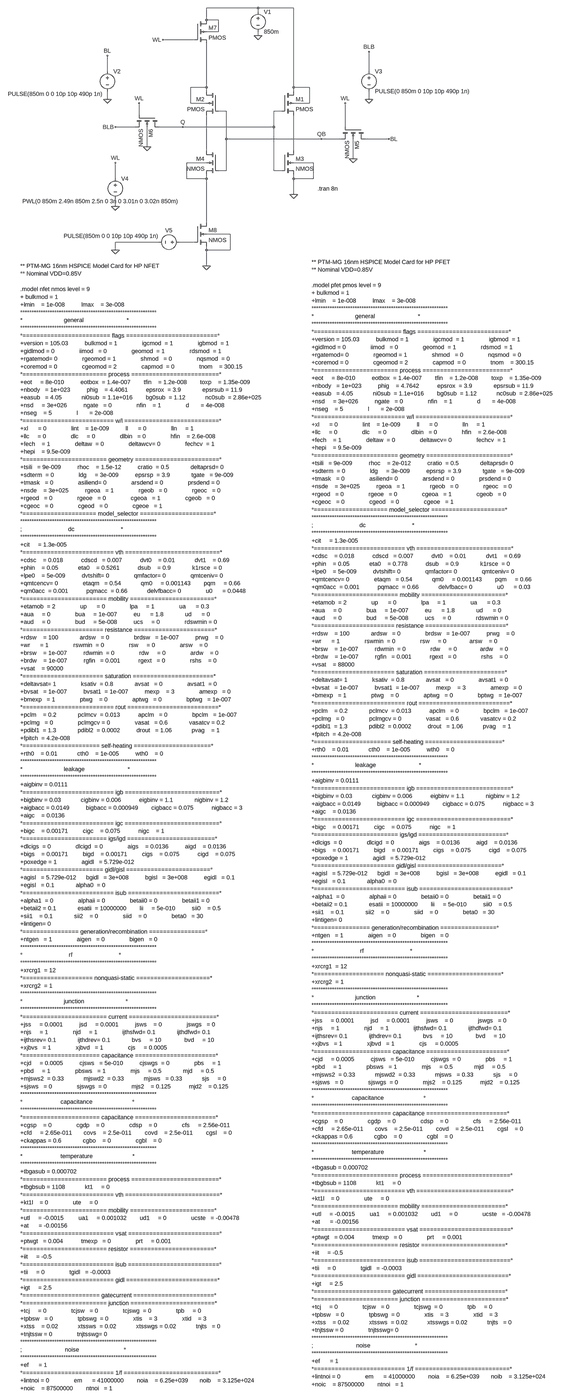
[diagram p0: schematic sram8t.asc, whole sheet]
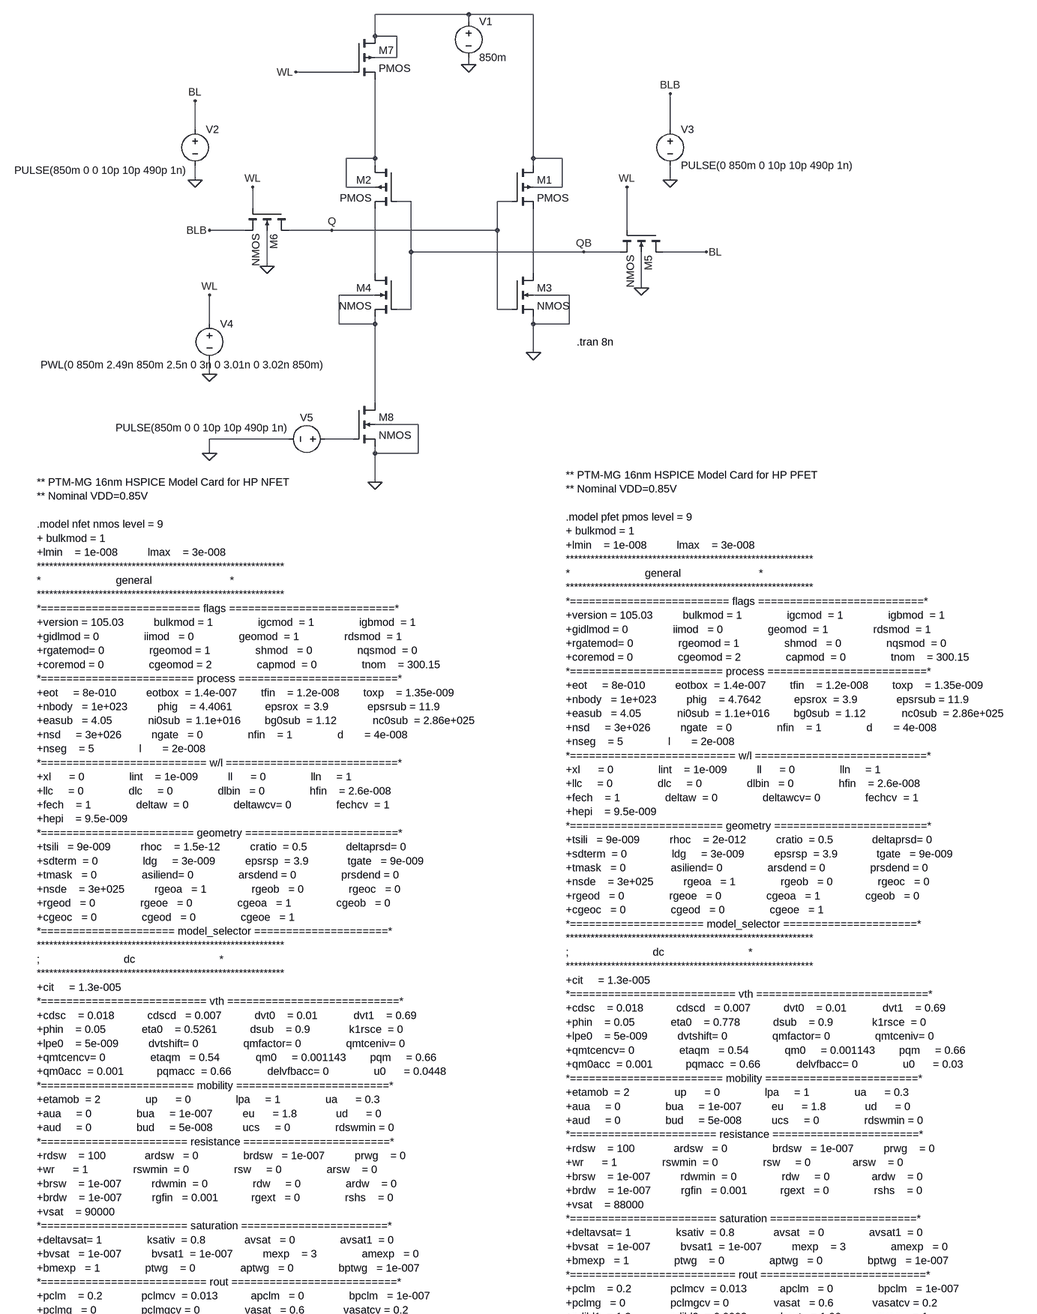
[diagram p1: schematic sram8t.asc, part, row 1 of 2, column 1 of 1]
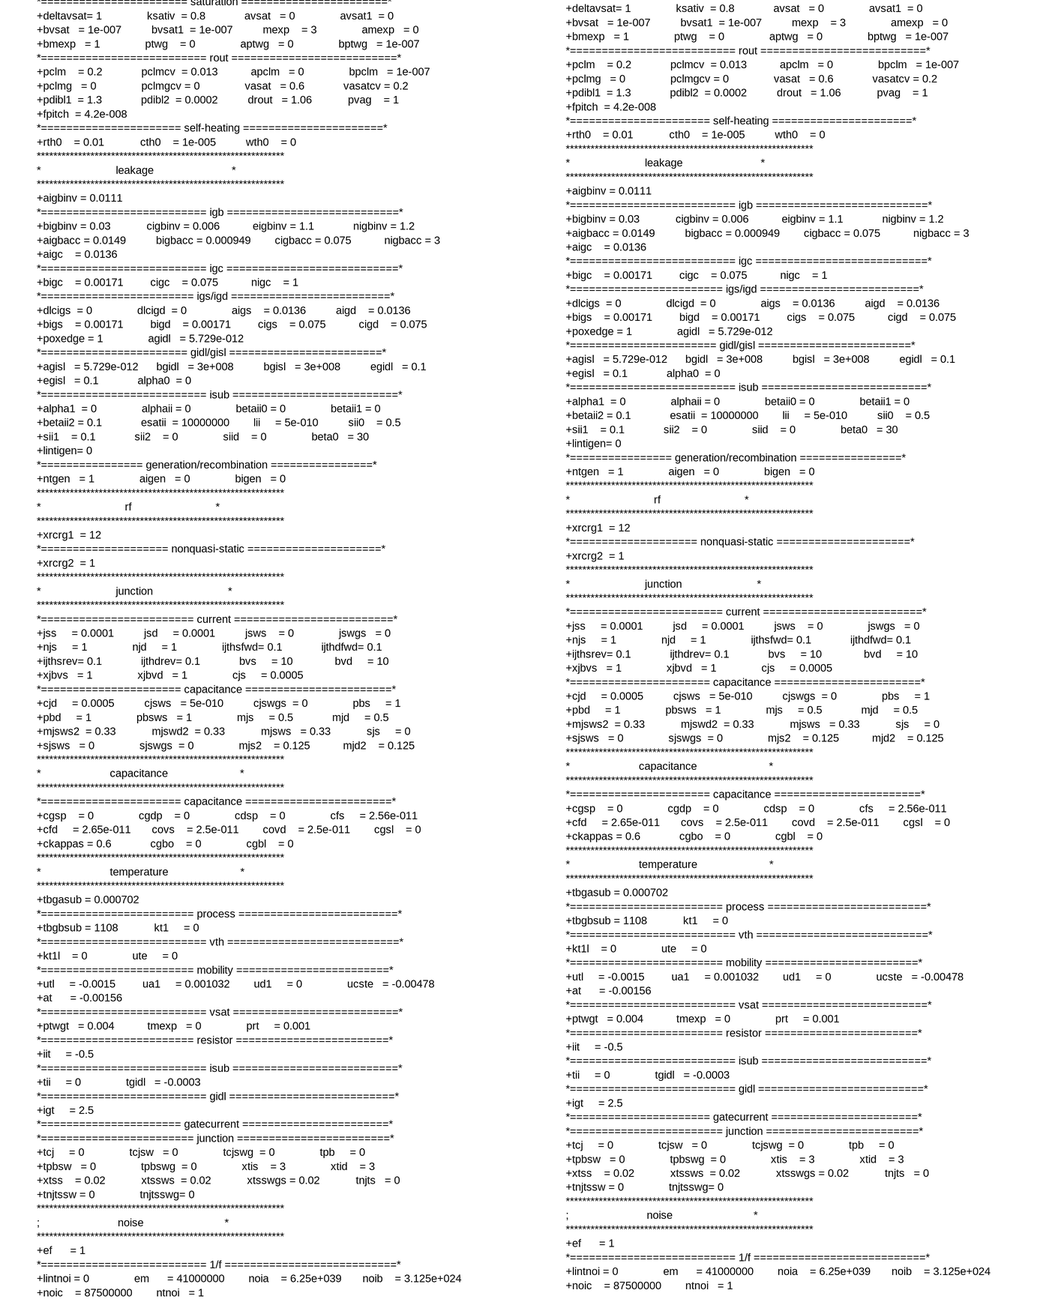
[diagram p2: schematic sram8t.asc, part, row 2 of 2, column 1 of 1]
sram8t.asc, the LTspice schematic file:
Version 4
SHEET 1 1636 4844
WIRE 224 -272 16 -272
WIRE 368 -272 224 -272
WIRE 224 -256 224 -272
WIRE 16 -224 16 -272
WIRE 64 -224 16 -224
WIRE 64 -176 64 -224
WIRE 64 -176 16 -176
WIRE 224 -160 224 -176
WIRE -32 -144 -160 -144
WIRE -384 -16 -384 -80
WIRE 672 -16 672 -96
WIRE 16 48 16 -128
WIRE 16 48 -48 48
WIRE 368 48 368 -272
WIRE 432 48 368 48
WIRE 16 64 16 48
WIRE 368 64 368 48
WIRE -384 96 -384 64
WIRE 672 96 672 64
WIRE -48 112 -48 48
WIRE 16 112 -48 112
WIRE 432 112 432 48
WIRE 432 112 368 112
WIRE 96 144 64 144
WIRE 320 144 288 144
WIRE -256 160 -256 112
WIRE -272 208 -352 208
WIRE -80 208 -176 208
WIRE 288 208 288 144
WIRE 288 208 -80 208
WIRE 576 208 576 112
WIRE 96 256 96 144
WIRE 480 256 96 256
WIRE 560 256 480 256
WIRE 752 256 656 256
WIRE -224 288 -224 208
WIRE 16 304 16 160
WIRE 368 304 368 160
WIRE 608 336 608 256
WIRE 16 352 -64 352
WIRE 448 352 368 352
WIRE 96 384 96 256
WIRE 96 384 64 384
WIRE 288 384 288 208
WIRE 320 384 288 384
WIRE -352 416 -352 352
WIRE -64 416 -64 352
WIRE 16 416 16 400
WIRE 16 416 -64 416
WIRE 368 416 368 400
WIRE 448 416 448 352
WIRE 448 416 368 416
WIRE 368 480 368 416
WIRE -352 528 -352 496
WIRE 16 592 16 416
WIRE 112 640 16 640
WIRE -176 672 -352 672
WIRE -32 672 -96 672
WIRE -352 704 -352 672
WIRE 16 704 16 688
WIRE 112 704 112 640
WIRE 112 704 16 704
WIRE 16 768 16 704
FLAG -224 288 0
FLAG 608 336 0
FLAG 224 -160 0
FLAG -384 96 0
FLAG -352 528 0
FLAG 672 96 0
FLAG -80 208 Q
FLAG 480 256 QB
FLAG 576 112 WL
FLAG -256 112 WL
FLAG 752 256 BL
FLAG -352 208 BLB
FLAG -352 352 WL
FLAG -384 -80 BL
FLAG 672 -96 BLB
FLAG -160 -144 WL
FLAG 368 480 0
FLAG 16 768 0
FLAG -352 704 0
SYMBOL pmos4 320 64 R0
SYMATTR InstName M1
SYMATTR Value2 l=20n w=320n
SYMBOL pmos4 64 64 M0
SYMATTR InstName M2
SYMATTR Value2 l=20n w=320n
SYMBOL nmos4 320 304 R0
SYMATTR InstName M3
SYMATTR Value2 l=20n w=960n
SYMBOL nmos4 64 304 M0
SYMATTR InstName M4
SYMATTR Value2 l=20n w=960n
SYMBOL nmos4 656 208 R90
SYMATTR InstName M5
SYMATTR Value2 l=20n w=128n
SYMBOL nmos4 -176 160 R90
SYMATTR InstName M6
SYMATTR Value2 l=20n w=128n
SYMBOL voltage 224 -272 R0
WINDOW 123 0 0 Left 0
WINDOW 39 0 0 Left 0
SYMATTR InstName V1
SYMATTR Value 850m
SYMBOL voltage -384 -32 R0
WINDOW 3 -17 107 Right 2
WINDOW 123 0 0 Left 0
WINDOW 39 0 0 Left 0
SYMATTR Value PULSE(850m 0 0 10p 10p 490p 1n)
SYMATTR InstName V2
SYMBOL voltage 672 -32 R0
WINDOW 123 0 0 Left 0
WINDOW 39 0 0 Left 0
SYMATTR InstName V3
SYMATTR Value PULSE(0 850m 0 10p 10p 490p 1n)
SYMBOL voltage -352 400 R0
WINDOW 3 260 107 Right 2
WINDOW 123 0 0 Left 0
WINDOW 39 0 0 Left 0
SYMATTR Value PWL(0 850m 2.49n 850m 2.5n 0 3n 0 3.01n 0 3.02n 850m)
SYMATTR InstName V4
SYMBOL pmos4 -32 -224 R0
SYMATTR InstName M7
SYMBOL nmos4 -32 592 R0
SYMATTR InstName M8
SYMBOL voltage -80 672 R90
WINDOW 0 -32 56 VBottom 2
WINDOW 3 -40 288 VTop 2
WINDOW 123 0 0 Left 0
WINDOW 39 0 0 Left 0
SYMATTR InstName V5
SYMATTR Value PULSE(850m 0 0 10p 10p 490p 1n)
TEXT -736 768 Left 2 !** PTM-MG 16nm HSPICE Model Card for HP NFET\n** Nominal VDD=0.85V\n \n.model nfet nmos level = 9 \n+ bulkmod = 1 \n+lmin    = 1e-008          lmax    = 3e-008        \n************************************************************\n*                         general                          *\n************************************************************\n*========================= flags ==========================*\n+version = 105.03          bulkmod = 1               igcmod  = 1               igbmod  = 1             \n+gidlmod = 0               iimod   = 0               geomod  = 1               rdsmod  = 1             \n+rgatemod= 0               rgeomod = 1               shmod   = 0               nqsmod  = 0             \n+coremod = 0               cgeomod = 2               capmod  = 0               tnom    = 300.15        \n*======================== process =========================*\n+eot     = 8e-010          eotbox  = 1.4e-007        tfin    = 1.2e-008        toxp    = 1.35e-009     \n+nbody   = 1e+023          phig    = 4.4061           epsrox  = 3.9             epsrsub = 11.9          \n+easub   = 4.05            ni0sub  = 1.1e+016        bg0sub  = 1.12            nc0sub  = 2.86e+025     \n+nsd     = 3e+026          ngate   = 0               nfin    = 1               d       = 4e-008        \n+nseg    = 5               l       = 2e-008        \n*========================== w/l ===========================*\n+xl      = 0               lint    = 1e-009          ll      = 0               lln     = 1             \n+llc     = 0               dlc     = 0               dlbin   = 0               hfin    = 2.6e-008      \n+fech    = 1               deltaw  = 0               deltawcv= 0               fechcv  = 1             \n+hepi    = 9.5e-009      \n*======================== geometry ========================*\n+tsili   = 9e-009          rhoc    = 1.5e-12          cratio  = 0.5             deltaprsd= 0             \n+sdterm  = 0               ldg     = 3e-009          epsrsp  = 3.9             tgate   = 9e-009        \n+tmask   = 0               asiliend= 0               arsdend = 0               prsdend = 0             \n+nsde    = 3e+025          rgeoa   = 1               rgeob   = 0               rgeoc   = 0             \n+rgeod   = 0               rgeoe   = 0               cgeoa   = 1               cgeob   = 0             \n+cgeoc   = 0               cgeod   = 0               cgeoe   = 1             \n*===================== model_selector =====================*\n************************************************************\n;                            dc                            *\n************************************************************\n+cit     = 1.3e-005      \n*========================== vth ===========================*\n+cdsc    = 0.018           cdscd   = 0.007           dvt0    = 0.01            dvt1    = 0.69          \n+phin    = 0.05            eta0    = 0.5261           dsub    = 0.9             k1rsce  = 0             \n+lpe0    = 5e-009          dvtshift= 0               qmfactor= 0               qmtceniv= 0             \n+qmtcencv= 0               etaqm   = 0.54            qm0     = 0.001143        pqm     = 0.66          \n+qm0acc  = 0.001           pqmacc  = 0.66            delvfbacc= 0               u0      = 0.0448        \n*======================== mobility ========================*\n+etamob  = 2               up      = 0               lpa     = 1               ua      = 0.3           \n+aua     = 0               bua     = 1e-007          eu      = 1.8             ud      = 0             \n+aud     = 0               bud     = 5e-008          ucs     = 0               rdswmin = 0             \n*======================= resistance =======================*\n+rdsw    = 100             ardsw   = 0               brdsw   = 1e-007          prwg    = 0             \n+wr      = 1               rswmin  = 0               rsw     = 0               arsw    = 0             \n+brsw    = 1e-007          rdwmin  = 0               rdw     = 0               ardw    = 0             \n+brdw    = 1e-007          rgfin   = 0.001           rgext   = 0               rshs    = 0             \n+vsat    = 90000         \n*======================= saturation =======================*\n+deltavsat= 1               ksativ  = 0.8             avsat   = 0               avsat1  = 0             \n+bvsat   = 1e-007          bvsat1  = 1e-007          mexp    = 3               amexp   = 0             \n+bmexp   = 1               ptwg    = 0               aptwg   = 0               bptwg   = 1e-007        \n*========================== rout ==========================*\n+pclm    = 0.2             pclmcv  = 0.013           apclm   = 0               bpclm   = 1e-007        \n+pclmg   = 0               pclmgcv = 0               vasat   = 0.6             vasatcv = 0.2           \n+pdibl1  = 1.3             pdibl2  = 0.0002          drout   = 1.06            pvag    = 1             \n+fpitch  = 4.2e-008      \n*====================== self-heating ======================*\n+rth0    = 0.01            cth0    = 1e-005          wth0    = 0             \n************************************************************\n*                         leakage                          *\n************************************************************\n+aigbinv = 0.0111        \n*========================== igb ===========================*\n+bigbinv = 0.03            cigbinv = 0.006           eigbinv = 1.1             nigbinv = 1.2             \n+aigbacc = 0.0149          bigbacc = 0.000949        cigbacc = 0.075           nigbacc = 3             \n+aigc    = 0.0136        \n*========================== igc ===========================*\n+bigc    = 0.00171         cigc    = 0.075           nigc    = 1             \n*======================== igs/igd =========================*\n+dlcigs  = 0               dlcigd  = 0               aigs    = 0.0136          aigd    = 0.0136        \n+bigs    = 0.00171         bigd    = 0.00171         cigs    = 0.075           cigd    = 0.075         \n+poxedge = 1               agidl   = 5.729e-012    \n*======================= gidl/gisl ========================*\n+agisl   = 5.729e-012      bgidl   = 3e+008          bgisl   = 3e+008          egidl   = 0.1           \n+egisl   = 0.1             alpha0  = 0             \n*========================== isub ==========================*\n+alpha1  = 0               alphaii = 0               betaii0 = 0               betaii1 = 0             \n+betaii2 = 0.1             esatii  = 10000000        lii     = 5e-010          sii0    = 0.5           \n+sii1    = 0.1             sii2    = 0               siid    = 0               beta0   = 30            \n+lintigen= 0             \n*================ generation/recombination ================*\n+ntgen   = 1               aigen   = 0               bigen   = 0             \n************************************************************\n*                            rf                            *\n************************************************************\n+xrcrg1  = 12            \n*==================== nonquasi-static =====================*\n+xrcrg2  = 1             \n************************************************************\n*                         junction                         *\n************************************************************\n*======================== current =========================*\n+jss     = 0.0001          jsd     = 0.0001          jsws    = 0               jswgs   = 0             \n+njs     = 1               njd     = 1               ijthsfwd= 0.1             ijthdfwd= 0.1           \n+ijthsrev= 0.1             ijthdrev= 0.1             bvs     = 10              bvd     = 10            \n+xjbvs   = 1               xjbvd   = 1               cjs     = 0.0005        \n*====================== capacitance =======================*\n+cjd     = 0.0005          cjsws   = 5e-010          cjswgs  = 0               pbs     = 1             \n+pbd     = 1               pbsws   = 1               mjs     = 0.5             mjd     = 0.5           \n+mjsws2  = 0.33            mjswd2  = 0.33            mjsws   = 0.33            sjs     = 0             \n+sjsws   = 0               sjswgs  = 0               mjs2    = 0.125           mjd2    = 0.125         \n************************************************************\n*                       capacitance                        *\n************************************************************\n*====================== capacitance =======================*\n+cgsp    = 0               cgdp    = 0               cdsp    = 0               cfs     = 2.56e-011     \n+cfd     = 2.65e-011       covs    = 2.5e-011        covd    = 2.5e-011        cgsl    = 0             \n+ckappas = 0.6             cgbo    = 0               cgbl    = 0             \n************************************************************\n*                       temperature                        *\n************************************************************\n+tbgasub = 0.000702      \n*======================== process =========================*\n+tbgbsub = 1108            kt1     = 0             \n*========================== vth ===========================*\n+kt1l    = 0               ute     = 0             \n*======================== mobility ========================*\n+utl     = -0.0015         ua1     = 0.001032        ud1     = 0               ucste   = -0.00478      \n+at      = -0.00156      \n*========================== vsat ==========================*\n+ptwgt   = 0.004           tmexp   = 0               prt     = 0.001         \n*======================== resistor ========================*\n+iit     = -0.5          \n*========================== isub ==========================*\n+tii     = 0               tgidl   = -0.0003       \n*========================== gidl ==========================*\n+igt     = 2.5           \n*====================== gatecurrent =======================*\n*======================== junction ========================*\n+tcj     = 0               tcjsw   = 0               tcjswg  = 0               tpb     = 0             \n+tpbsw   = 0               tpbswg  = 0               xtis    = 3               xtid    = 3             \n+xtss    = 0.02            xtssws  = 0.02            xtsswgs = 0.02            tnjts   = 0             \n+tnjtssw = 0               tnjtsswg= 0             \n************************************************************\n;                          noise                           *\n************************************************************\n+ef      = 1             \n*========================== 1/f ===========================*\n+lintnoi = 0               em      = 41000000        noia    = 6.25e+039       noib    = 3.125e+024    \n+noic    = 87500000        ntnoi   = 1
TEXT 440 752 Left 2 !** PTM-MG 16nm HSPICE Model Card for HP PFET \n** Nominal VDD=0.85V\n \n.model pfet pmos level = 9 \n+ bulkmod = 1 \n+lmin    = 1e-008          lmax    = 3e-008        \n************************************************************\n*                         general                          *\n************************************************************\n*========================= flags ==========================*\n+version = 105.03          bulkmod = 1               igcmod  = 1               igbmod  = 1             \n+gidlmod = 0               iimod   = 0               geomod  = 1               rdsmod  = 1             \n+rgatemod= 0               rgeomod = 1               shmod   = 0               nqsmod  = 0             \n+coremod = 0               cgeomod = 2               capmod  = 0               tnom    = 300.15        \n*======================== process =========================*\n+eot     = 8e-010          eotbox  = 1.4e-007        tfin    = 1.2e-008        toxp    = 1.35e-009     \n+nbody   = 1e+023          phig    = 4.7642           epsrox  = 3.9             epsrsub = 11.9          \n+easub   = 4.05            ni0sub  = 1.1e+016        bg0sub  = 1.12            nc0sub  = 2.86e+025     \n+nsd     = 3e+026          ngate   = 0               nfin    = 1               d       = 4e-008        \n+nseg    = 5               l       = 2e-008        \n*========================== w/l ===========================*\n+xl      = 0               lint    = 1e-009          ll      = 0               lln     = 1             \n+llc     = 0               dlc     = 0               dlbin   = 0               hfin    = 2.6e-008      \n+fech    = 1               deltaw  = 0               deltawcv= 0               fechcv  = 1             \n+hepi    = 9.5e-009      \n*======================== geometry ========================*\n+tsili   = 9e-009          rhoc    = 2e-012          cratio  = 0.5             deltaprsd= 0             \n+sdterm  = 0               ldg     = 3e-009          epsrsp  = 3.9             tgate   = 9e-009        \n+tmask   = 0               asiliend= 0               arsdend = 0               prsdend = 0             \n+nsde    = 3e+025          rgeoa   = 1               rgeob   = 0               rgeoc   = 0             \n+rgeod   = 0               rgeoe   = 0               cgeoa   = 1               cgeob   = 0             \n+cgeoc   = 0               cgeod   = 0               cgeoe   = 1             \n*===================== model_selector =====================*\n************************************************************\n;                            dc                            *\n************************************************************\n+cit     = 1.3e-005      \n*========================== vth ===========================*\n+cdsc    = 0.018           cdscd   = 0.007           dvt0    = 0.01            dvt1    = 0.69          \n+phin    = 0.05            eta0    = 0.778           dsub    = 0.9             k1rsce  = 0             \n+lpe0    = 5e-009          dvtshift= 0               qmfactor= 0               qmtceniv= 0             \n+qmtcencv= 0               etaqm   = 0.54            qm0     = 0.001143        pqm     = 0.66          \n+qm0acc  = 0.001           pqmacc  = 0.66            delvfbacc= 0               u0      = 0.03        \n*======================== mobility ========================*\n+etamob  = 2               up      = 0               lpa     = 1               ua      = 0.3           \n+aua     = 0               bua     = 1e-007          eu      = 1.8             ud      = 0             \n+aud     = 0               bud     = 5e-008          ucs     = 0               rdswmin = 0             \n*======================= resistance =======================*\n+rdsw    = 100             ardsw   = 0               brdsw   = 1e-007          prwg    = 0             \n+wr      = 1               rswmin  = 0               rsw     = 0              arsw    = 0             \n+brsw    = 1e-007          rdwmin  = 0               rdw     = 0              ardw    = 0             \n+brdw    = 1e-007          rgfin   = 0.001           rgext   = 0               rshs    = 0             \n+vsat    = 88000         \n*======================= saturation =======================*\n+deltavsat= 1               ksativ  = 0.8             avsat   = 0               avsat1  = 0             \n+bvsat   = 1e-007          bvsat1  = 1e-007          mexp    = 3               amexp   = 0             \n+bmexp   = 1               ptwg    = 0               aptwg   = 0               bptwg   = 1e-007        \n*========================== rout ==========================*\n+pclm    = 0.2             pclmcv  = 0.013           apclm   = 0               bpclm   = 1e-007        \n+pclmg   = 0               pclmgcv = 0               vasat   = 0.6             vasatcv = 0.2           \n+pdibl1  = 1.3             pdibl2  = 0.0002          drout   = 1.06            pvag    = 1             \n+fpitch  = 4.2e-008      \n*====================== self-heating ======================*\n+rth0    = 0.01            cth0    = 1e-005          wth0    = 0             \n************************************************************\n*                         leakage                          *\n************************************************************\n+aigbinv = 0.0111        \n*========================== igb ===========================*\n+bigbinv = 0.03            cigbinv = 0.006           eigbinv = 1.1             nigbinv = 1.2             \n+aigbacc = 0.0149          bigbacc = 0.000949        cigbacc = 0.075           nigbacc = 3             \n+aigc    = 0.0136        \n*========================== igc ===========================*\n+bigc    = 0.00171         cigc    = 0.075           nigc    = 1             \n*======================== igs/igd =========================*\n+dlcigs  = 0               dlcigd  = 0               aigs    = 0.0136          aigd    = 0.0136        \n+bigs    = 0.00171         bigd    = 0.00171         cigs    = 0.075           cigd    = 0.075         \n+poxedge = 1               agidl   = 5.729e-012    \n*======================= gidl/gisl ========================*\n+agisl   = 5.729e-012      bgidl   = 3e+008          bgisl   = 3e+008          egidl   = 0.1           \n+egisl   = 0.1             alpha0  = 0             \n*========================== isub ==========================*\n+alpha1  = 0               alphaii = 0               betaii0 = 0               betaii1 = 0             \n+betaii2 = 0.1             esatii  = 10000000        lii     = 5e-010          sii0    = 0.5           \n+sii1    = 0.1             sii2    = 0               siid    = 0               beta0   = 30            \n+lintigen= 0             \n*================ generation/recombination ================*\n+ntgen   = 1               aigen   = 0               bigen   = 0             \n************************************************************\n*                            rf                            *\n************************************************************\n+xrcrg1  = 12            \n*==================== nonquasi-static =====================*\n+xrcrg2  = 1             \n************************************************************\n*                         junction                         *\n************************************************************\n*======================== current =========================*\n+jss     = 0.0001          jsd     = 0.0001          jsws    = 0               jswgs   = 0             \n+njs     = 1               njd     = 1               ijthsfwd= 0.1             ijthdfwd= 0.1           \n+ijthsrev= 0.1             ijthdrev= 0.1             bvs     = 10              bvd     = 10            \n+xjbvs   = 1               xjbvd   = 1               cjs     = 0.0005        \n*====================== capacitance =======================*\n+cjd     = 0.0005          cjsws   = 5e-010          cjswgs  = 0               pbs     = 1             \n+pbd     = 1               pbsws   = 1               mjs     = 0.5             mjd     = 0.5           \n+mjsws2  = 0.33            mjswd2  = 0.33            mjsws   = 0.33            sjs     = 0             \n+sjsws   = 0               sjswgs  = 0               mjs2    = 0.125           mjd2    = 0.125         \n************************************************************\n*                       capacitance                        *\n************************************************************\n*====================== capacitance =======================*\n+cgsp    = 0               cgdp    = 0               cdsp    = 0               cfs     = 2.56e-011     \n+cfd     = 2.65e-011       covs    = 2.5e-011        covd    = 2.5e-011        cgsl    = 0             \n+ckappas = 0.6             cgbo    = 0               cgbl    = 0             \n************************************************************\n*                       temperature                        *\n************************************************************\n+tbgasub = 0.000702      \n*======================== process =========================*\n+tbgbsub = 1108            kt1     = 0             \n*========================== vth ===========================*\n+kt1l    = 0               ute     = 0             \n*======================== mobility ========================*\n+utl     = -0.0015         ua1     = 0.001032        ud1     = 0               ucste   = -0.00478      \n+at      = -0.00156      \n*========================== vsat ==========================*\n+ptwgt   = 0.004           tmexp   = 0               prt     = 0.001         \n*======================== resistor ========================*\n+iit     = -0.5          \n*========================== isub ==========================*\n+tii     = 0               tgidl   = -0.0003       \n*========================== gidl ==========================*\n+igt     = 2.5           \n*====================== gatecurrent =======================*\n*======================== junction ========================*\n+tcj     = 0               tcjsw   = 0               tcjswg  = 0               tpb     = 0             \n+tpbsw   = 0               tpbswg  = 0               xtis    = 3               xtid    = 3             \n+xtss    = 0.02            xtssws  = 0.02            xtsswgs = 0.02            tnjts   = 0             \n+tnjtssw = 0               tnjtsswg= 0             \n************************************************************\n;                          noise                           *\n************************************************************\n+ef      = 1             \n*========================== 1/f ===========================*\n+lintnoi = 0               em      = 41000000        noia    = 6.25e+039       noib    = 3.125e+024    \n+noic    = 87500000        ntnoi   = 1
TEXT 464 456 Left 2 !.tran 8n

The netlist it stands for:
* sram8t.asc
M1 N001 Q N004 N001 PMOS l=20n w=320n
M2 N002 QB N003 N002 PMOS l=20n w=320n
M3 N004 Q 0 0 NMOS l=20n w=960n
M4 N003 QB N005 N005 NMOS l=20n w=960n
M5 BL WL QB 0 NMOS l=20n w=128n
M6 Q WL BLB 0 NMOS l=20n w=128n
V1 N001 0 850m
V2 BL 0 PULSE(850m 0 0 10p 10p 490p 1n)
V3 BLB 0 PULSE(0 850m 0 10p 10p 490p 1n)
V4 WL 0 PWL(0 850m 2.49n 850m 2.5n 0 3n 0 3.01n 0 3.02n 850m)
M7 N001 WL N002 N001 PMOS
M8 N005 N006 0 0 NMOS
V5 N006 0 PULSE(850m 0 0 10p 10p 490p 1n)
.model NMOS NMOS
.model PMOS PMOS
.lib standard.mos
** PTM-MG 16nm HSPICE Model Card for HP NFET
** Nominal VDD=0.85V
.model nfet nmos level = 9
+ bulkmod = 1
+lmin    = 1e-008          lmax    = 3e-008
************************************************************
*                         general                          *
************************************************************
*========================= flags ==========================*
+version = 105.03          bulkmod = 1               igcmod  = 1               igbmod  = 1
+gidlmod = 0               iimod   = 0               geomod  = 1               rdsmod  = 1
+rgatemod= 0               rgeomod = 1               shmod   = 0               nqsmod  = 0
+coremod = 0               cgeomod = 2               capmod  = 0               tnom    = 300.15
*======================== process =========================*
+eot     = 8e-010          eotbox  = 1.4e-007        tfin    = 1.2e-008        toxp    = 1.35e-009
+nbody   = 1e+023          phig    = 4.4061           epsrox  = 3.9             epsrsub = 11.9
+easub   = 4.05            ni0sub  = 1.1e+016        bg0sub  = 1.12            nc0sub  = 2.86e+025
+nsd     = 3e+026          ngate   = 0               nfin    = 1               d       = 4e-008
+nseg    = 5               l       = 2e-008
*========================== w/l ===========================*
+xl      = 0               lint    = 1e-009          ll      = 0               lln     = 1
+llc     = 0               dlc     = 0               dlbin   = 0               hfin    = 2.6e-008
+fech    = 1               deltaw  = 0               deltawcv= 0               fechcv  = 1
+hepi    = 9.5e-009
*======================== geometry ========================*
+tsili   = 9e-009          rhoc    = 1.5e-12          cratio  = 0.5             deltaprsd= 0
+sdterm  = 0               ldg     = 3e-009          epsrsp  = 3.9             tgate   = 9e-009
+tmask   = 0               asiliend= 0               arsdend = 0               prsdend = 0
+nsde    = 3e+025          rgeoa   = 1               rgeob   = 0               rgeoc   = 0
+rgeod   = 0               rgeoe   = 0               cgeoa   = 1               cgeob   = 0
+cgeoc   = 0               cgeod   = 0               cgeoe   = 1
*===================== model_selector =====================*
************************************************************
;                            dc                            *
************************************************************
+cit     = 1.3e-005
*========================== vth ===========================*
+cdsc    = 0.018           cdscd   = 0.007           dvt0    = 0.01            dvt1    = 0.69
+phin    = 0.05            eta0    = 0.5261           dsub    = 0.9             k1rsce  = 0
+lpe0    = 5e-009          dvtshift= 0               qmfactor= 0               qmtceniv= 0
+qmtcencv= 0               etaqm   = 0.54            qm0     = 0.001143        pqm     = 0.66
+qm0acc  = 0.001           pqmacc  = 0.66            delvfbacc= 0               u0      = 0.0448
*======================== mobility ========================*
+etamob  = 2               up      = 0               lpa     = 1               ua      = 0.3
+aua     = 0               bua     = 1e-007          eu      = 1.8             ud      = 0
+aud     = 0               bud     = 5e-008          ucs     = 0               rdswmin = 0
*======================= resistance =======================*
+rdsw    = 100             ardsw   = 0               brdsw   = 1e-007          prwg    = 0
+wr      = 1               rswmin  = 0               rsw     = 0               arsw    = 0
+brsw    = 1e-007          rdwmin  = 0               rdw     = 0               ardw    = 0
+brdw    = 1e-007          rgfin   = 0.001           rgext   = 0               rshs    = 0
+vsat    = 90000
*======================= saturation =======================*
+deltavsat= 1               ksativ  = 0.8             avsat   = 0               avsat1  = 0
+bvsat   = 1e-007          bvsat1  = 1e-007          mexp    = 3               amexp   = 0
+bmexp   = 1               ptwg    = 0               aptwg   = 0               bptwg   = 1e-007
*========================== rout ==========================*
+pclm    = 0.2             pclmcv  = 0.013           apclm   = 0               bpclm   = 1e-007
+pclmg   = 0               pclmgcv = 0               vasat   = 0.6             vasatcv = 0.2
+pdibl1  = 1.3             pdibl2  = 0.0002          drout   = 1.06            pvag    = 1
+fpitch  = 4.2e-008
*====================== self-heating ======================*
+rth0    = 0.01            cth0    = 1e-005          wth0    = 0
************************************************************
*                         leakage                          *
************************************************************
+aigbinv = 0.0111
*========================== igb ===========================*
+bigbinv = 0.03            cigbinv = 0.006           eigbinv = 1.1             nigbinv = 1.2
+aigbacc = 0.0149          bigbacc = 0.000949        cigbacc = 0.075           nigbacc = 3
+aigc    = 0.0136
*========================== igc ===========================*
+bigc    = 0.00171         cigc    = 0.075           nigc    = 1
*======================== igs/igd =========================*
+dlcigs  = 0               dlcigd  = 0               aigs    = 0.0136          aigd    = 0.0136
+bigs    = 0.00171         bigd    = 0.00171         cigs    = 0.075           cigd    = 0.075
+poxedge = 1               agidl   = 5.729e-012
*======================= gidl/gisl ========================*
+agisl   = 5.729e-012      bgidl   = 3e+008          bgisl   = 3e+008          egidl   = 0.1
+egisl   = 0.1             alpha0  = 0
*========================== isub ==========================*
+alpha1  = 0               alphaii = 0               betaii0 = 0               betaii1 = 0
+betaii2 = 0.1             esatii  = 10000000        lii     = 5e-010          sii0    = 0.5
+sii1    = 0.1             sii2    = 0               siid    = 0               beta0   = 30
+lintigen= 0
*================ generation/recombination ================*
+ntgen   = 1               aigen   = 0               bigen   = 0
************************************************************
*                            rf                            *
************************************************************
+xrcrg1  = 12
*==================== nonquasi-static =====================*
+xrcrg2  = 1
************************************************************
*                         junction                         *
************************************************************
*======================== current =========================*
+jss     = 0.0001          jsd     = 0.0001          jsws    = 0               jswgs   = 0
+njs     = 1               njd     = 1               ijthsfwd= 0.1             ijthdfwd= 0.1
+ijthsrev= 0.1             ijthdrev= 0.1             bvs     = 10              bvd     = 10
+xjbvs   = 1               xjbvd   = 1               cjs     = 0.0005
*====================== capacitance =======================*
+cjd     = 0.0005          cjsws   = 5e-010          cjswgs  = 0               pbs     = 1
+pbd     = 1               pbsws   = 1               mjs     = 0.5             mjd     = 0.5
+mjsws2  = 0.33            mjswd2  = 0.33            mjsws   = 0.33            sjs     = 0
+sjsws   = 0               sjswgs  = 0               mjs2    = 0.125           mjd2    = 0.125
************************************************************
*                       capacitance                        *
************************************************************
*====================== capacitance =======================*
+cgsp    = 0               cgdp    = 0               cdsp    = 0               cfs     = 2.56e-011
+cfd     = 2.65e-011       covs    = 2.5e-011        covd    = 2.5e-011        cgsl    = 0
+ckappas = 0.6             cgbo    = 0               cgbl    = 0
************************************************************
*                       temperature                        *
************************************************************
+tbgasub = 0.000702
*======================== process =========================*
+tbgbsub = 1108            kt1     = 0
*========================== vth ===========================*
+kt1l    = 0               ute     = 0
*======================== mobility ========================*
+utl     = -0.0015         ua1     = 0.001032        ud1     = 0               ucste   = -0.00478
+at      = -0.00156
*========================== vsat ==========================*
+ptwgt   = 0.004           tmexp   = 0               prt     = 0.001
*======================== resistor ========================*
+iit     = -0.5
*========================== isub ==========================*
+tii     = 0               tgidl   = -0.0003
*========================== gidl ==========================*
+igt     = 2.5
*====================== gatecurrent =======================*
*======================== junction ========================*
+tcj     = 0               tcjsw   = 0               tcjswg  = 0               tpb     = 0
+tpbsw   = 0               tpbswg  = 0               xtis    = 3               xtid    = 3
+xtss    = 0.02            xtssws  = 0.02            xtsswgs = 0.02            tnjts   = 0
+tnjtssw = 0               tnjtsswg= 0
************************************************************
;                          noise                           *
************************************************************
+ef      = 1
*========================== 1/f ===========================*
+lintnoi = 0               em      = 41000000        noia    = 6.25e+039       noib    = 3.125e+024
+noic    = 87500000        ntnoi   = 1
** PTM-MG 16nm HSPICE Model Card for HP PFET
** Nominal VDD=0.85V
.model pfet pmos level = 9
+ bulkmod = 1
+lmin    = 1e-008          lmax    = 3e-008
************************************************************
*                         general                          *
************************************************************
*========================= flags ==========================*
+version = 105.03          bulkmod = 1               igcmod  = 1               igbmod  = 1
+gidlmod = 0               iimod   = 0               geomod  = 1               rdsmod  = 1
+rgatemod= 0               rgeomod = 1               shmod   = 0               nqsmod  = 0
+coremod = 0               cgeomod = 2               capmod  = 0               tnom    = 300.15
*======================== process =========================*
+eot     = 8e-010          eotbox  = 1.4e-007        tfin    = 1.2e-008        toxp    = 1.35e-009
+nbody   = 1e+023          phig    = 4.7642           epsrox  = 3.9             epsrsub = 11.9
+easub   = 4.05            ni0sub  = 1.1e+016        bg0sub  = 1.12            nc0sub  = 2.86e+025
+nsd     = 3e+026          ngate   = 0               nfin    = 1               d       = 4e-008
+nseg    = 5               l       = 2e-008
*========================== w/l ===========================*
+xl      = 0               lint    = 1e-009          ll      = 0               lln     = 1
+llc     = 0               dlc     = 0               dlbin   = 0               hfin    = 2.6e-008
+fech    = 1               deltaw  = 0               deltawcv= 0               fechcv  = 1
+hepi    = 9.5e-009
*======================== geometry ========================*
+tsili   = 9e-009          rhoc    = 2e-012          cratio  = 0.5             deltaprsd= 0
+sdterm  = 0               ldg     = 3e-009          epsrsp  = 3.9             tgate   = 9e-009
+tmask   = 0               asiliend= 0               arsdend = 0               prsdend = 0
+nsde    = 3e+025          rgeoa   = 1               rgeob   = 0               rgeoc   = 0
+rgeod   = 0               rgeoe   = 0               cgeoa   = 1               cgeob   = 0
+cgeoc   = 0               cgeod   = 0               cgeoe   = 1
*===================== model_selector =====================*
************************************************************
;                            dc                            *
************************************************************
+cit     = 1.3e-005
*========================== vth ===========================*
+cdsc    = 0.018           cdscd   = 0.007           dvt0    = 0.01            dvt1    = 0.69
+phin    = 0.05            eta0    = 0.778           dsub    = 0.9             k1rsce  = 0
+lpe0    = 5e-009          dvtshift= 0               qmfactor= 0               qmtceniv= 0
+qmtcencv= 0               etaqm   = 0.54            qm0     = 0.001143        pqm     = 0.66
+qm0acc  = 0.001           pqmacc  = 0.66            delvfbacc= 0               u0      = 0.03
*======================== mobility ========================*
+etamob  = 2               up      = 0               lpa     = 1               ua      = 0.3
+aua     = 0               bua     = 1e-007          eu      = 1.8             ud      = 0
+aud     = 0               bud     = 5e-008          ucs     = 0               rdswmin = 0
*======================= resistance =======================*
+rdsw    = 100             ardsw   = 0               brdsw   = 1e-007          prwg    = 0
+wr      = 1               rswmin  = 0               rsw     = 0              arsw    = 0
+brsw    = 1e-007          rdwmin  = 0               rdw     = 0              ardw    = 0
+brdw    = 1e-007          rgfin   = 0.001           rgext   = 0               rshs    = 0
+vsat    = 88000
*======================= saturation =======================*
+deltavsat= 1               ksativ  = 0.8             avsat   = 0               avsat1  = 0
+bvsat   = 1e-007          bvsat1  = 1e-007          mexp    = 3               amexp   = 0
+bmexp   = 1               ptwg    = 0               aptwg   = 0               bptwg   = 1e-007
*========================== rout ==========================*
+pclm    = 0.2             pclmcv  = 0.013           apclm   = 0               bpclm   = 1e-007
+pclmg   = 0               pclmgcv = 0               vasat   = 0.6             vasatcv = 0.2
+pdibl1  = 1.3             pdibl2  = 0.0002          drout   = 1.06            pvag    = 1
+fpitch  = 4.2e-008
*====================== self-heating ======================*
+rth0    = 0.01            cth0    = 1e-005          wth0    = 0
************************************************************
*                         leakage                          *
************************************************************
+aigbinv = 0.0111
*========================== igb ===========================*
+bigbinv = 0.03            cigbinv = 0.006           eigbinv = 1.1             nigbinv = 1.2
+aigbacc = 0.0149          bigbacc = 0.000949        cigbacc = 0.075           nigbacc = 3
+aigc    = 0.0136
*========================== igc ===========================*
+bigc    = 0.00171         cigc    = 0.075           nigc    = 1
*======================== igs/igd =========================*
+dlcigs  = 0               dlcigd  = 0               aigs    = 0.0136          aigd    = 0.0136
+bigs    = 0.00171         bigd    = 0.00171         cigs    = 0.075           cigd    = 0.075
+poxedge = 1               agidl   = 5.729e-012
*======================= gidl/gisl ========================*
+agisl   = 5.729e-012      bgidl   = 3e+008          bgisl   = 3e+008          egidl   = 0.1
+egisl   = 0.1             alpha0  = 0
*========================== isub ==========================*
+alpha1  = 0               alphaii = 0               betaii0 = 0               betaii1 = 0
+betaii2 = 0.1             esatii  = 10000000        lii     = 5e-010          sii0    = 0.5
+sii1    = 0.1             sii2    = 0               siid    = 0               beta0   = 30
+lintigen= 0
*================ generation/recombination ================*
+ntgen   = 1               aigen   = 0               bigen   = 0
************************************************************
*                            rf                            *
************************************************************
+xrcrg1  = 12
*==================== nonquasi-static =====================*
+xrcrg2  = 1
************************************************************
*                         junction                         *
************************************************************
*======================== current =========================*
+jss     = 0.0001          jsd     = 0.0001          jsws    = 0               jswgs   = 0
+njs     = 1               njd     = 1               ijthsfwd= 0.1             ijthdfwd= 0.1
+ijthsrev= 0.1             ijthdrev= 0.1             bvs     = 10              bvd     = 10
+xjbvs   = 1               xjbvd   = 1               cjs     = 0.0005
*====================== capacitance =======================*
+cjd     = 0.0005          cjsws   = 5e-010          cjswgs  = 0               pbs     = 1
+pbd     = 1               pbsws   = 1               mjs     = 0.5             mjd     = 0.5
+mjsws2  = 0.33            mjswd2  = 0.33            mjsws   = 0.33            sjs     = 0
+sjsws   = 0               sjswgs  = 0               mjs2    = 0.125           mjd2    = 0.125
************************************************************
*                       capacitance                        *
************************************************************
*====================== capacitance =======================*
+cgsp    = 0               cgdp    = 0               cdsp    = 0               cfs     = 2.56e-011
+cfd     = 2.65e-011       covs    = 2.5e-011        covd    = 2.5e-011        cgsl    = 0
+ckappas = 0.6             cgbo    = 0               cgbl    = 0
************************************************************
*                       temperature                        *
************************************************************
+tbgasub = 0.000702
*======================== process =========================*
+tbgbsub = 1108            kt1     = 0
*========================== vth ===========================*
+kt1l    = 0               ute     = 0
*======================== mobility ========================*
+utl     = -0.0015         ua1     = 0.001032        ud1     = 0               ucste   = -0.00478
+at      = -0.00156
*========================== vsat ==========================*
+ptwgt   = 0.004           tmexp   = 0               prt     = 0.001
*======================== resistor ========================*
+iit     = -0.5
*========================== isub ==========================*
+tii     = 0               tgidl   = -0.0003
*========================== gidl ==========================*
+igt     = 2.5
*====================== gatecurrent =======================*
*======================== junction ========================*
+tcj     = 0               tcjsw   = 0               tcjswg  = 0               tpb     = 0
+tpbsw   = 0               tpbswg  = 0               xtis    = 3               xtid    = 3
+xtss    = 0.02            xtssws  = 0.02            xtsswgs = 0.02            tnjts   = 0
+tnjtssw = 0               tnjtsswg= 0
************************************************************
;                          noise                           *
************************************************************
+ef      = 1
*========================== 1/f ===========================*
+lintnoi = 0               em      = 41000000        noia    = 6.25e+039       noib    = 3.125e+024
+noic    = 87500000        ntnoi   = 1
.tran 8n
.backanno
.end